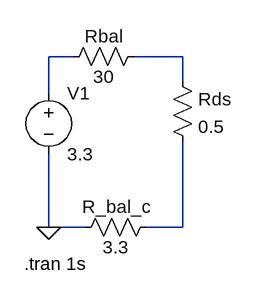
[diagram p0: schematic balancing.asc]
balancing.asc, the LTspice schematic file:
Version 4
SHEET 1 880 680
WIRE 240 112 208 112
WIRE 384 112 320 112
WIRE 384 144 384 112
WIRE 208 160 208 112
WIRE 208 336 208 240
WIRE 256 336 208 336
WIRE 384 336 384 224
WIRE 384 336 336 336
FLAG 208 336 0
SYMBOL voltage 208 144 R0
WINDOW 123 0 0 Left 0
WINDOW 39 0 0 Left 0
SYMATTR InstName V1
SYMATTR Value 3.3
SYMBOL res 336 96 R90
WINDOW 0 5 56 VBottom 2
WINDOW 3 27 56 VTop 2
SYMATTR InstName Rbal
SYMATTR Value 30
SYMBOL res 352 320 R90
WINDOW 0 5 56 VBottom 2
WINDOW 3 27 56 VTop 2
SYMATTR InstName R_bal_c
SYMATTR Value 3.3
SYMBOL res 368 128 R0
SYMATTR InstName Rds
SYMATTR Value 0.5
TEXT 176 384 Left 2 !.tran 1s

The netlist it stands for:
* balancing.asc
V1 N001 0 3.3
Rbal N002 N001 30
R_bal_c N003 0 3.3
Rds N002 N003 0.5
.tran 1s
.backanno
.end